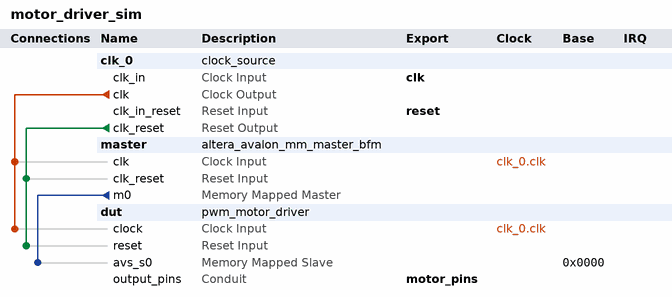
[diagram p0: system contents]
# Platform Designer (Qsys) system motor_driver_sim, Cyclone V 5CSEMA4U23C6
# Parameters at their usual value, and those the tool derives, are not listed.
package require -exact qsys 15.1
create_system motor_driver_sim
set_project_property DEVICE_FAMILY {Cyclone V}
set_project_property DEVICE 5CSEMA4U23C6

add_instance clk_0 clock_source 15.1
set_instance_parameter_value clk_0 clockFrequency 50000000

add_instance master altera_avalon_mm_master_bfm 15.1
set_instance_parameter_value master ADDRESS_UNITS SYMBOLS
set_instance_parameter_value master AV_ADDRESS_W 32
set_instance_parameter_value master AV_ALWAYS_BURST_MAX_BURST 0
set_instance_parameter_value master AV_BURSTCOUNT_W 3
set_instance_parameter_value master AV_BURST_BNDR_ONLY 1
set_instance_parameter_value master AV_BURST_LINEWRAP 1
set_instance_parameter_value master AV_CONSTANT_BURST_BEHAVIOR 1
set_instance_parameter_value master AV_FIX_READ_LATENCY 1
set_instance_parameter_value master AV_MAX_PENDING_WRITES 0
set_instance_parameter_value master AV_NUMSYMBOLS 4
set_instance_parameter_value master AV_READRESPONSE_W 8
set_instance_parameter_value master AV_READ_WAIT_TIME 1
set_instance_parameter_value master AV_WRITERESPONSE_W 8
set_instance_parameter_value master USE_BURSTCOUNT 0
set_instance_parameter_value master USE_BYTE_ENABLE 0
set_instance_parameter_value master USE_READ 1
set_instance_parameter_value master USE_READ_DATA 1
set_instance_parameter_value master USE_READ_DATA_VALID 1
set_instance_parameter_value master USE_WAIT_REQUEST 1
set_instance_parameter_value master VHDL_ID 0

add_instance dut pwm_motor_driver 1.0
set_instance_parameter_value dut bits_resolution 8
set_instance_parameter_value dut phases 1
set_instance_parameter_value dut pwm_freq 100000
set_instance_parameter_value dut sys_clk 50000000

# connections
add_connection clk_0.clk dut.clock clock
add_connection clk_0.clk master.clk clock
add_connection clk_0.clk_reset dut.reset reset
add_connection clk_0.clk_reset master.clk_reset reset
add_connection master.m0 dut.avs_s0 avalon
set_connection_parameter_value master.m0/dut.avs_s0 baseAddress 0x0000

# exported interfaces
add_interface clk clock sink
set_interface_property clk EXPORT_OF clk_0.clk_in
add_interface motor_pins conduit end
set_interface_property motor_pins EXPORT_OF dut.output_pins
add_interface reset reset sink
set_interface_property reset EXPORT_OF clk_0.clk_in_reset

set_interconnect_requirement {$system} qsys_mm.clockCrossingAdapter HANDSHAKE
set_interconnect_requirement {$system} qsys_mm.enableEccProtection FALSE
set_interconnect_requirement {$system} qsys_mm.insertDefaultSlave FALSE
set_interconnect_requirement {$system} qsys_mm.maxAdditionalLatency 1

save_system motor_driver_sim.qsys
